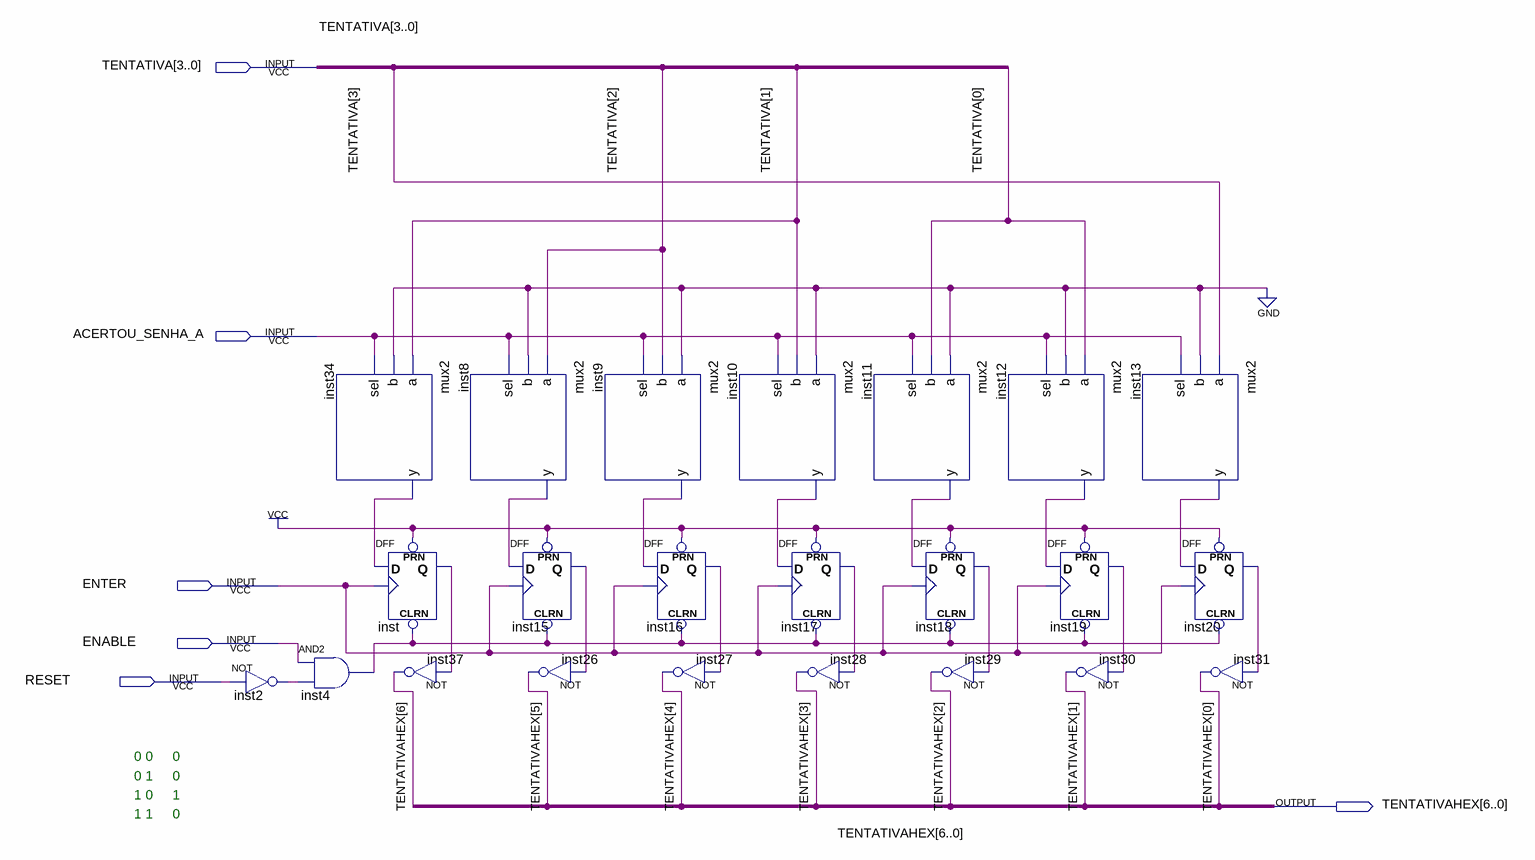
[diagram p0: schematic sheet]
// Quartus schematic MostrarTentativa.bdf as structural Verilog: 23 symbols, 6 pins
module MostrarTentativa (
  input  [3:0] TENTATIVA,
  input  ACERTOU_SENHA_A,
  input  ENTER,
  input  ENABLE,
  input  RESET,
  output [6:0] TENTATIVAHEX
);

  wire inst2_out, inst4_out, inst8_y, inst9_y, inst10_y, inst11_y, inst12_y, inst13_y, inst15_q, inst16_q,
       inst17_q, inst18_q, inst19_q, inst20_q, inst34_y, inst_q;

  not inst2 (inst2_out, RESET);
  mux2 inst34 (.a(TENTATIVA[1]), .b(1'b0), .sel(ACERTOU_SENHA_A), .y(inst34_y));
  and inst4 (inst4_out, ENABLE, inst2_out);
  DFF inst (.CLRN(inst4_out), .CLK(ENTER), .D(inst34_y), .PRN(1'b1), .Q(inst_q));
  not inst37 (TENTATIVAHEX[6], inst_q);
  mux2 inst8 (.a(TENTATIVA[2]), .b(1'b0), .sel(ACERTOU_SENHA_A), .y(inst8_y));
  DFF inst15 (.CLRN(inst4_out), .CLK(ENTER), .D(inst8_y), .PRN(1'b1), .Q(inst15_q));
  not inst26 (TENTATIVAHEX[5], inst15_q);
  mux2 inst9 (.a(1'b0), .b(TENTATIVA[2]), .sel(ACERTOU_SENHA_A), .y(inst9_y));
  DFF inst16 (.CLRN(inst4_out), .CLK(ENTER), .D(inst9_y), .PRN(1'b1), .Q(inst16_q));
  not inst27 (TENTATIVAHEX[4], inst16_q);
  mux2 inst10 (.a(1'b0), .b(TENTATIVA[1]), .sel(ACERTOU_SENHA_A), .y(inst10_y));
  DFF inst17 (.CLRN(inst4_out), .CLK(ENTER), .D(inst10_y), .PRN(1'b1), .Q(inst17_q));
  mux2 inst11 (.a(1'b0), .b(TENTATIVA[0]), .sel(ACERTOU_SENHA_A), .y(inst11_y));
  not inst28 (TENTATIVAHEX[3], inst17_q);
  DFF inst18 (.CLRN(inst4_out), .CLK(ENTER), .D(inst11_y), .PRN(1'b1), .Q(inst18_q));
  not inst29 (TENTATIVAHEX[2], inst18_q);
  mux2 inst12 (.a(TENTATIVA[0]), .b(1'b0), .sel(ACERTOU_SENHA_A), .y(inst12_y));
  DFF inst19 (.CLRN(inst4_out), .CLK(ENTER), .D(inst12_y), .PRN(1'b1), .Q(inst19_q));
  not inst30 (TENTATIVAHEX[1], inst19_q);
  mux2 inst13 (.a(TENTATIVA[3]), .b(1'b0), .sel(ACERTOU_SENHA_A), .y(inst13_y));
  DFF inst20 (.CLRN(inst4_out), .CLK(ENTER), .D(inst13_y), .PRN(1'b1), .Q(inst20_q));
  not inst31 (TENTATIVAHEX[0], inst20_q);

  // Notes on the sheet:
  //   0 0
  //   0
  //   0 1
  //   0
  //   1 0
  //   1
  //   1 1
  //   0
endmodule
